# EAGLE design TCRT1010_VIS.pac (EAGLE 9.6.2)

## Sheet 1 of 2
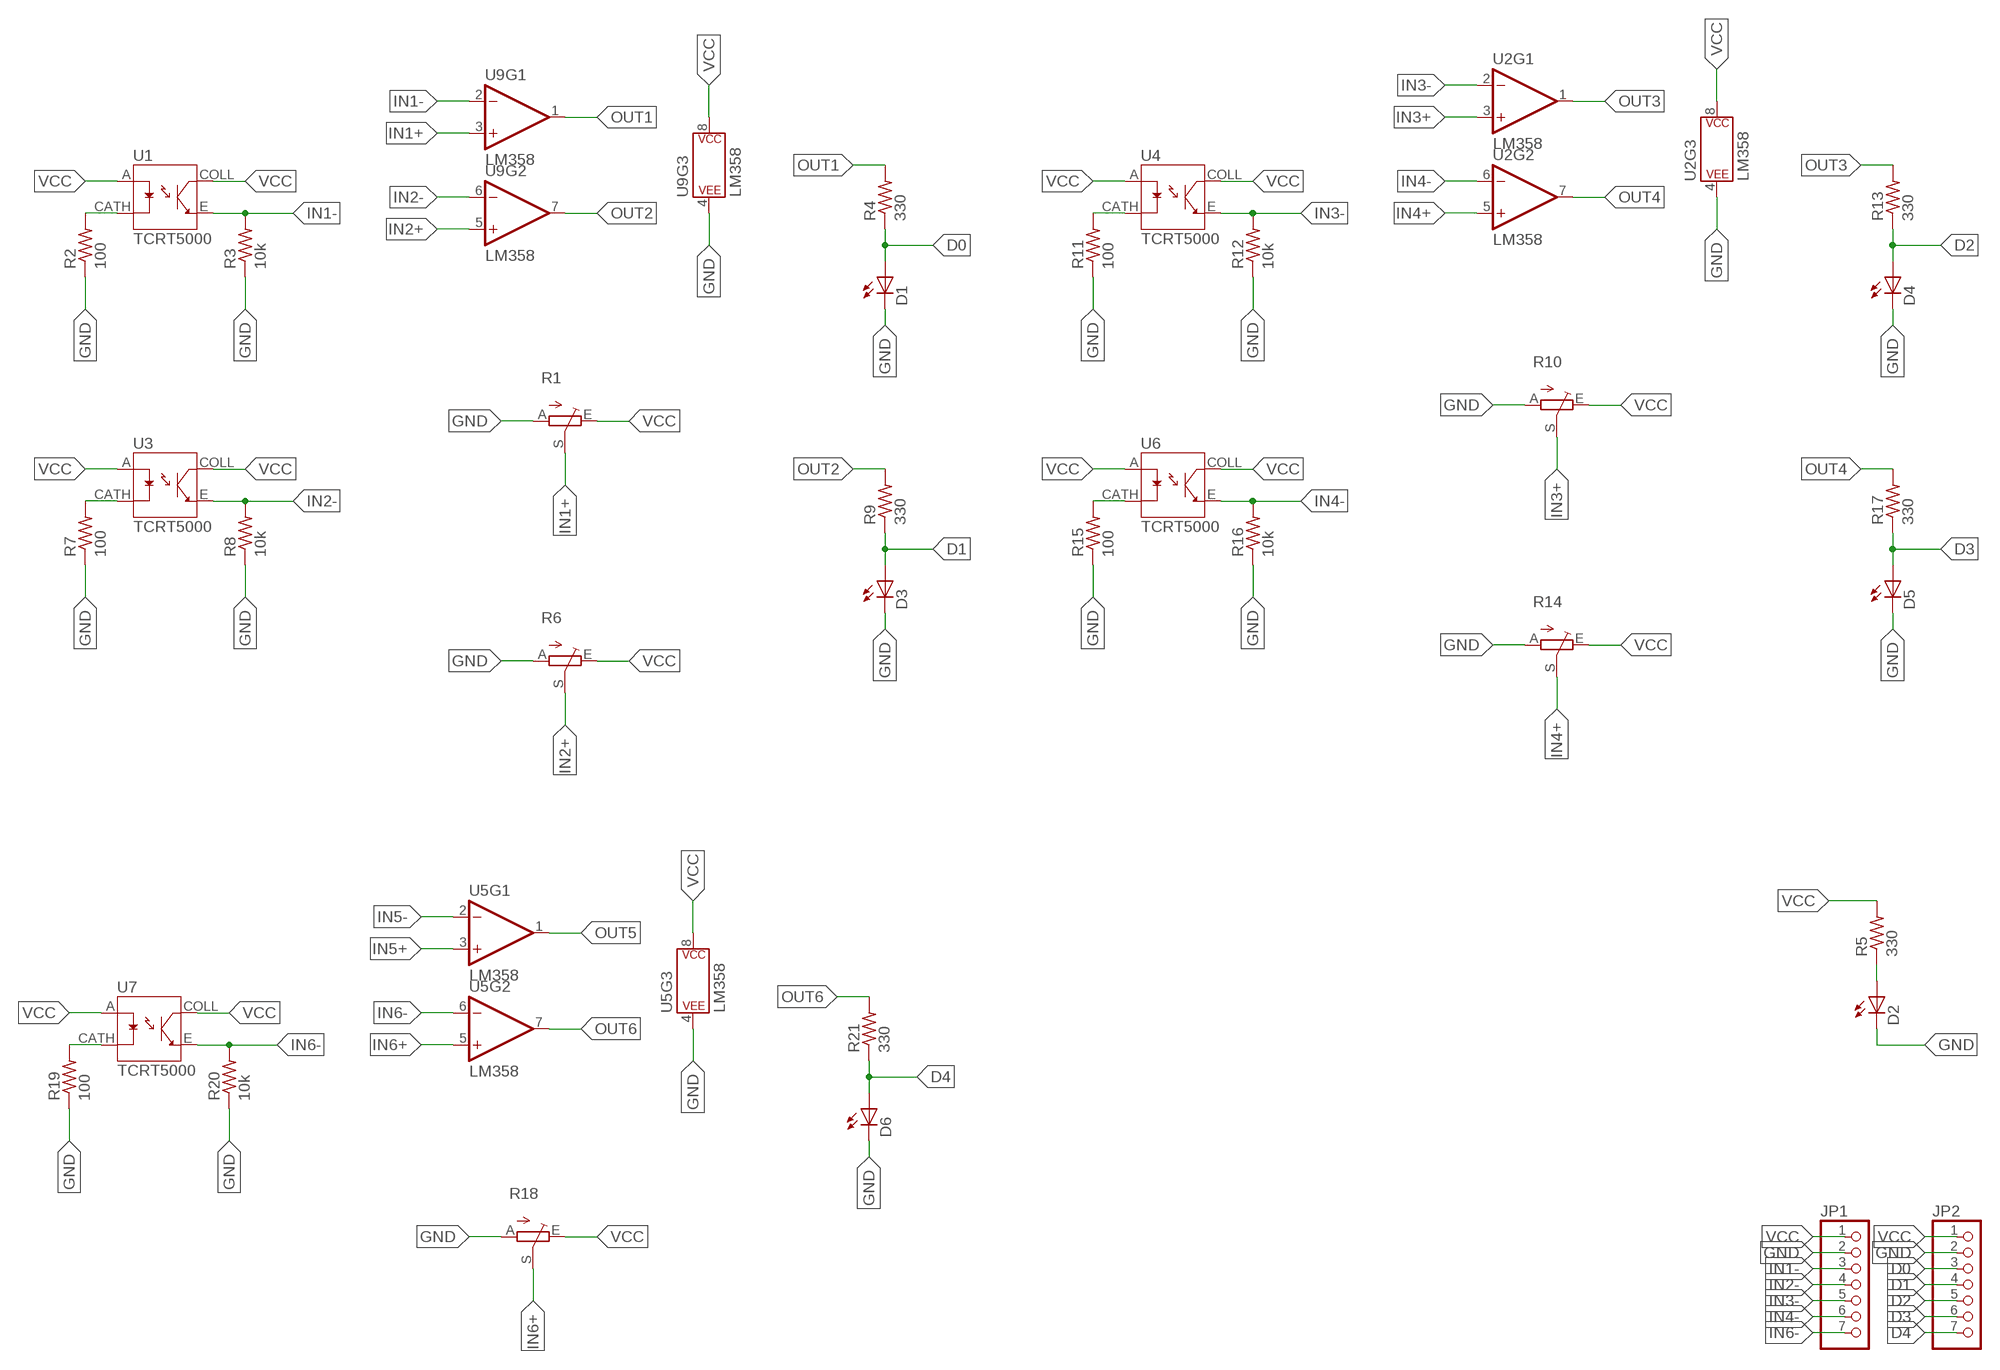
[diagram p0: schematic, sheet 1]

### Parts
D1  LED5MM  [LED5MM]
D2  LED5MM  [LED5MM]
D3  LED5MM  [LED5MM]
D4  LED5MM  [LED5MM]
D5  LED5MM  [LED5MM]
D6  LED5MM  [LED5MM]
JP1  PINHD-1X7  [1X07]
JP2  PINHD-1X7  [1X07]
R1  TRIM_EU-CA6V  [CA6V]
R2  100  RES-7  [0204/7]
R3  10k  RES-7  [0204/7]
R4  330  RES-7  [0204/7]
R5  330  RES-7  [0204/7]
R6  TRIM_EU-CA6V  [CA6V]
R7  100  RES-7  [0204/7]
R8  10k  RES-7  [0204/7]
R9  330  RES-7  [0204/7]
R10  TRIM_EU-CA6V  [CA6V]
R11  100  RES-7  [0204/7]
R12  10k  RES-7  [0204/7]
R13  330  RES-7  [0204/7]
R14  TRIM_EU-CA6V  [CA6V]
R15  100  RES-7  [0204/7]
R16  10k  RES-7  [0204/7]
R17  330  RES-7  [0204/7]
R18  TRIM_EU-CA6V  [CA6V]
R19  100  RES-7  [0204/7]
R20  10k  RES-7  [0204/7]
R21  330  RES-7  [0204/7]
U1  TCRT5000  [OPTO_TCRT5000]
U2  LM358  [DIP08]
U3  TCRT5000  [OPTO_TCRT5000]
U4  TCRT5000  [OPTO_TCRT5000]
U5  LM358  [DIP08]
U6  TCRT5000  [OPTO_TCRT5000]
U7  TCRT5000  [OPTO_TCRT5000]
U9  LM358  [DIP08]

### Nets
D0: D1.A JP2.3 R4.1
D1: D3.A JP2.4 R9.1
D2: D4.A JP2.5 R13.1
D3: D5.A JP2.6 R17.1
D4: D6.A JP2.7 R21.1
GND: D1.K(C) D2.K(C) D3.K(C) D4.K(C) D5.K(C) D6.K(C) JP1.2 JP2.2 R1.A R2.1 R3.1 R6.A R7.1 R8.1 R10.A R11.1 R12.1 R14.A R15.1 R16.1 R18.A R19.1 R20.1 U2.4(P$V-) U5.4(P$V-) U9.4(P$V-)
IN1+: R1.S U9.3(+IN)
IN1-: JP1.3 R3.2 U1.E U9.2(-IN)
IN2+: R6.S U9.5(+IN)
IN2-: JP1.4 R8.2 U3.E U9.6(-IN)
IN3+: R10.S U2.3(+IN)
IN3-: JP1.5 R12.2 U2.2(-IN) U4.E
IN4+: R14.S U2.5(+IN)
IN4-: JP1.6 R16.2 U2.6(-IN) U6.E
IN5+: U5.3(+IN)
IN5-: U5.2(-IN)
IN6+: R18.S U5.5(+IN)
IN6-: JP1.7 R20.2 U5.6(-IN) U7.E
N$1: R2.2 U1.CATH
N$2: D2.A R5.1
N$3: R7.2 U3.CATH
N$4: R11.2 U4.CATH
N$5: R15.2 U6.CATH
N$6: R19.2 U7.CATH
OUT1: R4.2 U9.1(OUT)
OUT2: R9.2 U9.7(OUT)
OUT3: R13.2 U2.1(OUT)
OUT4: R17.2 U2.7(OUT)
OUT5: U5.1(OUT)
OUT6: R21.2 U5.7(OUT)
VCC: JP1.1 JP2.1 R1.E R5.2 R6.E R10.E R14.E R18.E U1.A U1.COLL U2.8(P$V+) U3.A U3.COLL U4.A U4.COLL U5.8(P$V+) U6.A U6.COLL U7.A U7.COLL U9.8(P$V+)

## Sheet 2 of 2

## Library data of the parts
D1-D6 = MIA_LIBRARY-2-2-2:LED5MM
JP1 JP2 = MIA_LIBRARY-2-2-2:PINHD-1X7: PIN HEADER
R1 R6 R10 R14 R18 = MIA_LIBRARY-2-2-2:TRIM_EU-: POTENTIOMETER
R2-R5 R7-R9 R11-R13 R15-R17 R19-R21 = MIA_LIBRARY-2-2-2:RES-7
U1 U3 U4 U6 U7 = TCRT5000:TCRT5000: 950 nm 60 mA Through Hole Reflective Optical Sensor with Transistor Output Check availability <https://pricing.snapeda.com/parts/TCRT5000/Vishay/view-part?ref=eda>; AVAILABILITY: In Stock; DESCRIPTION: Reflective Optical Sensor 0.591 (15mm) PCB Mount; MF: Vishay; MP: TCRT5000; PACKAGE: TCRT5000 Vishay; PRICE: None; PURCHASE-URL: https://pricing.snapeda.com/search/part/TCRT5000/?ref=eda
U2 U5 U9 = MIA_LIBRARY-2-2-2:LM358: LM358 Jellybean op-amp Datasheet <http://www.sparkfun.com/datasheets/Components/General/LM358.pdf> SparkFun Products Op-Amp (Thru-Hole) - LM358 <https://www.sparkfun.com/products/9456> (COM-09456); PROD_ID: IC-09172

## Board
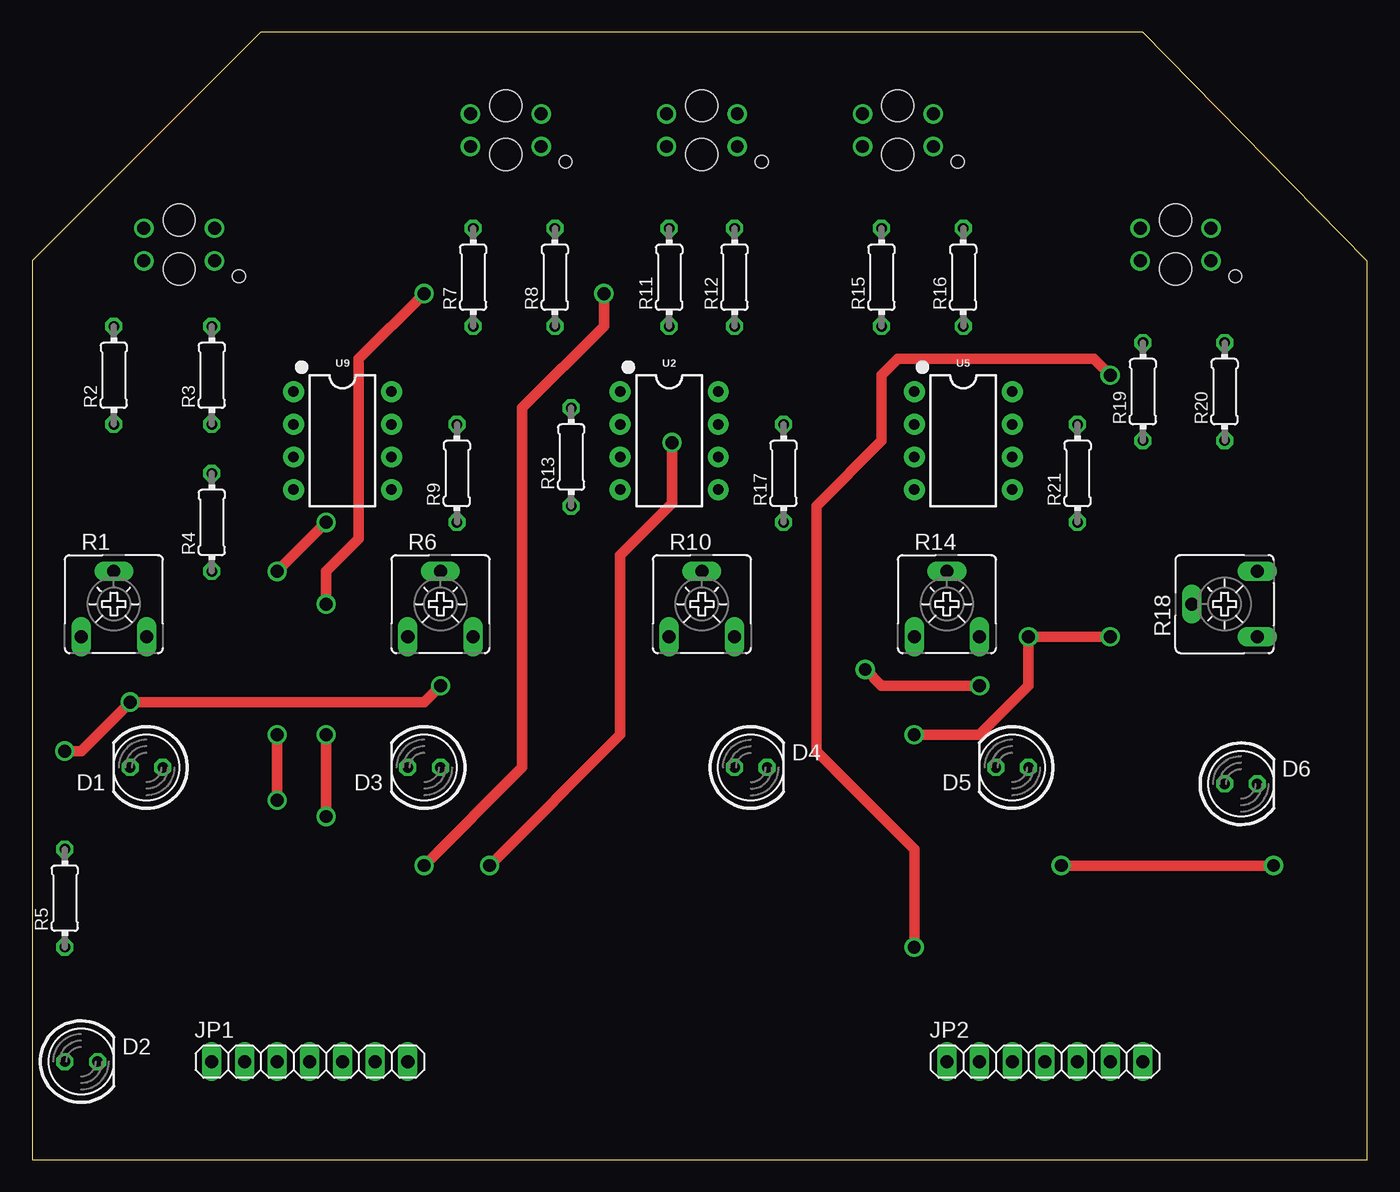
[diagram p1: board, top side]
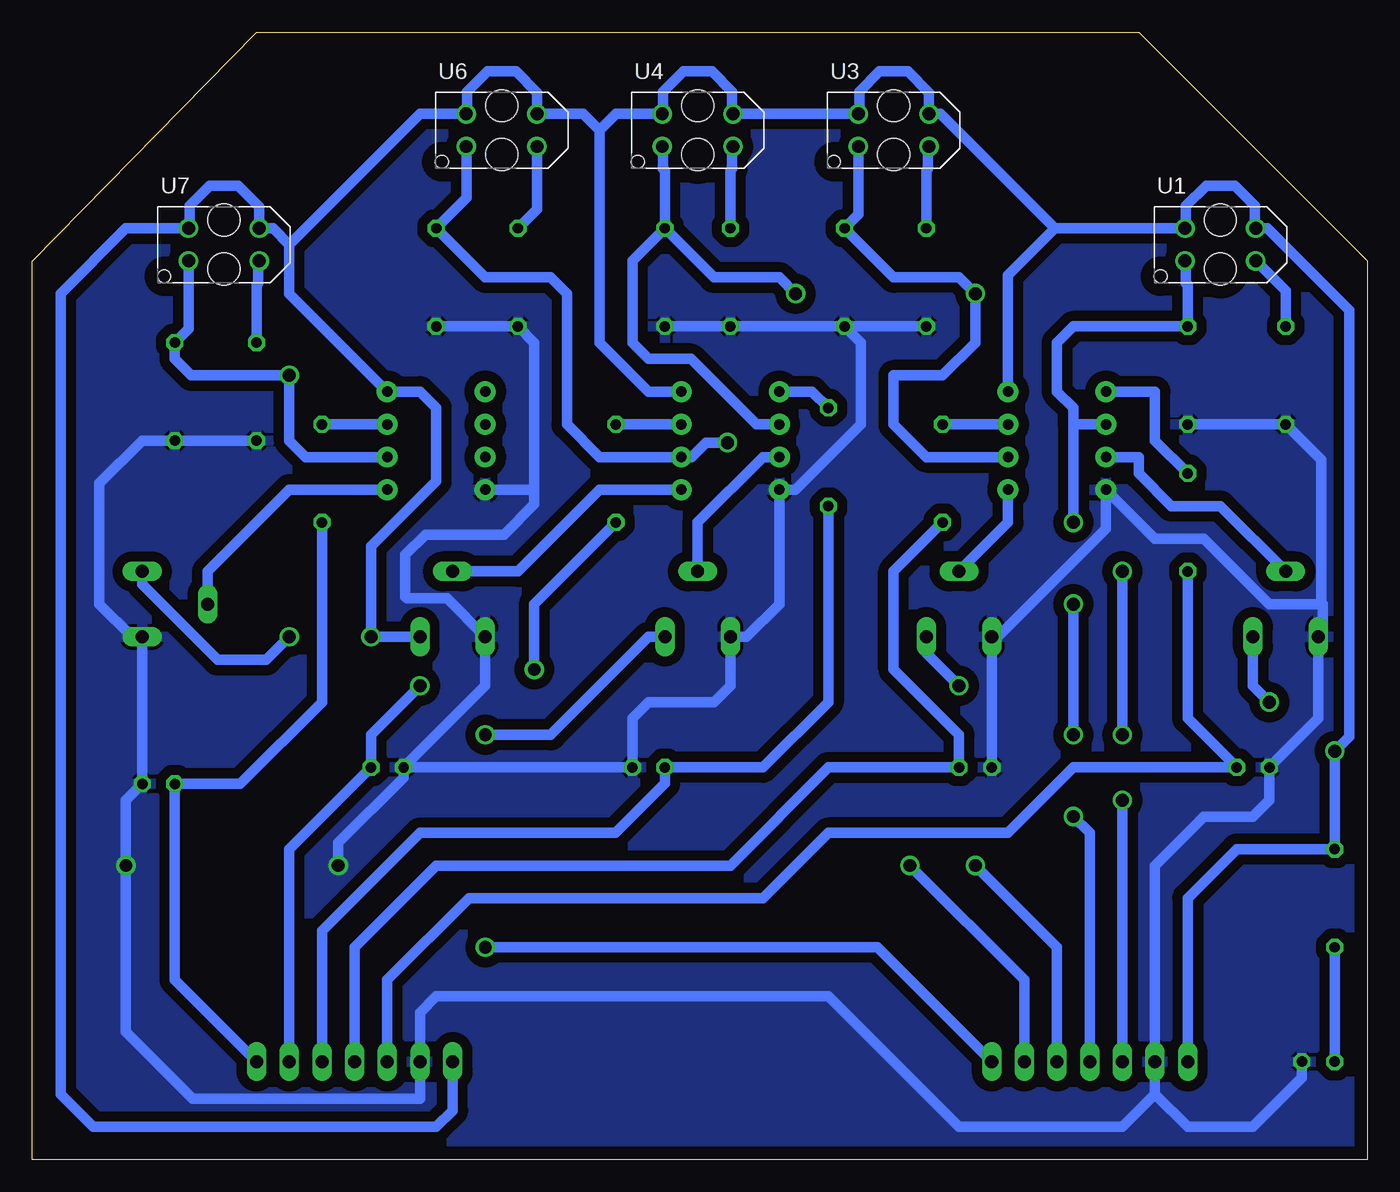
[diagram p2: board, bottom side, seen from below]

Size 103.81 x 87.63 mm. Coordinates in mm from the lower left corner, seen from the top.
Outline: 0,0 103.81,0 103.81,69.84 86.36,87.63 17.78,87.63 0,69.85 0,0
Copper layers (1*16): Top 0.035mm / dielectric 1.5mm / Bottom 0.035mm
Design rules "default *": minimum track width 6mil, minimum drill 0.35mm, track to track 0.8mm, track to pad 0.8mm, pad to pad 0.8mm, via to via 0.8mm, smd to smd 6mil, copper to edge 40mil, drill to drill 6mil, minimum pad ring 10mil, minimum via ring 8mil, stop-mask expansion 4mil, vias tented up to drill 0mil, thermal gap 10mil

### Footprints (pad centres in the part's own frame; a part is rotated, then mirrored left to right if it is on the bottom)
LED5MM = drill 0.813 octagon: A -1.27,0; K 1.27,0
1X07 = drill 1.016 long: 1 -7.62,0; 2 -5.08,0; 3 -2.54,0; 4 0,0; 5 2.54,0; 6 5.08,0; 7 7.62,0
CA6V = drill 1.016 long: A -2.54,-2.54; E 2.54,-2.54; S 0,2.54
0204/7 = drill 0.813 octagon: 1 -3.81,0; 2 3.81,0
OPTO_TCRT5000 = drill 1 pad 1.5: A 2.75,1.27; CATH 2.75,-1.27; COLL -2.75,1.27; E -2.75,-1.27 | hole 1: -4.65,-2.45 | hole 2.5: 0,-1.9; 0,1.9
DIP08 = drill 0.813 pad 1.626: 1 -3.81,-3.81; 2 -1.27,-3.81; 3 1.27,-3.81; 4 3.81,-3.81; 5 3.81,3.81; 6 1.27,3.81; 7 -1.27,3.81; 8 -3.81,3.81

### Placement (x,y rotation side)
D1  8.89,30.48 180 top
D2  3.81,7.62 0 top
D3  30.48,30.48 180 top
D4  55.88,30.48 0 top
D5  76.2,30.48 180 top
D6  93.98,29.21 0 top
JP1  21.59,7.62 0 top
JP2  78.74,7.62 0 top
R1  6.35,43.18 0 top
R2  6.35,60.96 90 top
R3  13.97,60.96 90 top
R4  13.97,49.53 90 top
R5  2.54,20.32 90 top
R6  31.75,43.18 0 top
R7  34.29,68.58 90 top
R8  40.64,68.58 90 top
R9  33.02,53.34 90 top
R10  52.07,43.18 0 top
R11  49.53,68.58 90 top
R12  54.61,68.58 90 top
R13  41.91,54.61 90 top
R14  71.12,43.18 0 top
R15  66.04,68.58 90 top
R16  72.39,68.58 90 top
R17  58.42,53.34 90 top
R18  92.71,43.18 90 top
R19  86.36,59.69 90 top
R20  92.71,59.69 90 top
R21  81.28,53.34 90 top
U1  11.43,71.12 0 bottom
U2  49.53,55.88 270 top
U3  36.83,80.01 0 bottom
U4  52.07,80.01 0 bottom
U5  72.39,55.88 270 top
U6  67.31,80.01 0 bottom
U7  88.9,71.12 0 bottom
U9  24.13,55.88 270 top

### Tracks (layer width: path | path; a pad name or v marks a point on that pad's centre or on a via)
D0
  Bottom 0.813: R4.1 13.97,34.29 D1.A 22.86,30.48 27.94,25.4 41.91,25.4 46.99,20.32 69.85,20.32 76.2,13.97 JP2.3
D1
  Bottom 0.813: R9.1 36.83,45.72 36.83,38.1 31.75,33.02 D3.A 41.91,30.48 49.53,22.86 72.39,22.86 78.74,16.51 JP2.4
D2
  Bottom 0.813: R13.1 41.91,35.56 46.99,30.48 D4.A 54.61,29.25 58.46,25.4 73.66,25.4 81.28,17.78 JP2.5
D3  (via drill 1)
  Top 0.813: v64.77,38.1 66.04,36.83 v73.66,36.83
  Bottom 0.813: JP2.6 83.82,24.13 D5.A 77.47,33.02 v73.66,36.83 | R17.1 64.77,43.18 v64.77,38.1
D4
  Bottom 0.813: JP2.7 92.71,13.97 D6.A 87.63,29.21 81.28,35.56 R21.1
GND  (via drill 1)
  Top 0.813: v80.01,22.86 v96.52,22.86
  Bottom 0.813: D3.K R6.A 28.72,40.64 20.32,49.04 U9.4 16.51,48.26 12.7,48.26 7.62,43.18 3.59,43.18 | 64.77,52.07 U5.4 | 64.77,52.07 64.77,50.93 67.12,48.58 73.24,48.58 74.8,47.01 74.8,43.77 74.67,43.63 71.57,43.63 R14.A 68.58,36.83 D5.K | D5.K D4.K 57.15,34.29 55.88,35.56 50.8,35.56 49.53,36.83 R10.A 48.26,40.64 45.72,43.18 U2.4 44.45,52.07 39.37,57.15 39.37,63.5 R8.1 | D2.K 5.08,6.35 8.89,2.54 13.97,2.54 16.51,5.08 | 16.51,5.08 JP1.2 16.51,22.86 12.7,26.67 8.89,26.67 7.62,27.94 D1.K 3.81,34.29 R1.A 3.47,40.98 3.47,43.18 3.59,43.18 | D5.K 74.93,29.7 80.01,24.62 v80.01,22.86 | 16.51,5.08 19.05,2.54 31.75,2.54 41.91,12.7 72.39,12.7 73.66,11.43 JP2.2 73.66,4.74 91.33,4.74 96.52,9.94 v96.52,22.86 96.52,27.94 D6.K R18.A 96.04,40.64 98.58,43.18 98.58,52.55 95.25,55.88 R20.1 R19.1 | R16.1 R15.1 64.77,63.5 64.77,52.07 | R7.1 R8.1 | R3.1 R2.1 3.59,54.39 3.59,43.18 | R12.1 R11.1 R8.1
  pour Bottom: 0,0 0,71.12 16.51,87.63 17.78,87.63 87.63,87.63 104.14,71.12 104.14,0
IN1+
  Bottom 0.813: R1.S 11.43,50.8 15.24,50.8 17.78,53.34 17.78,54.61 U9.3
IN1-  (via drill 1)
  Top 0.813: v22.86,49.53 v19.05,45.72 | v19.05,33.02 v19.05,27.94
  Bottom 0.813: U9.2 22.86,57.15 | 22.86,57.15 22.86,58.42 24.13,59.69 24.13,63.5 22.86,64.77 R3.2 13.97,67.98 14.1,68.11 14.1,69.77 U1.E | 22.86,57.15 v22.86,49.53 | v19.05,45.72 v19.05,33.02 | v19.05,27.94 JP1.3
IN2+
  Bottom 0.813: R6.S 27.94,49.53 U9.5
IN2-  (via drill 1)
  Top 0.813: v22.86,26.67 v22.86,33.02 | v22.86,43.18 22.86,45.72 25.4,48.26 25.4,62.23 v30.48,67.31
  Bottom 0.813: U9.6 34.29,54.61 36.83,57.15 36.83,60.96 33.02,60.96 30.48,63.5 v30.48,67.31 31.75,68.58 36.83,68.58 R8.2 39.56,73.47 39.56,78.36 39.58,78.38 U3.E | JP1.4 21.59,25.4 v22.86,26.67 | v22.86,33.02 v22.86,43.18
IN3+
  Bottom 0.813: U2.3 46.99,54.61 52.07,49.53 R10.S
IN3-  (via drill 1)
  Top 0.813: v30.48,22.86 38.1,30.48 38.1,58.42 44.45,64.77 v44.45,67.31
  Bottom 0.813: JP1.5 24.13,16.51 v30.48,22.86 | U2.2 47.51,57.15 52.59,62.23 55.88,62.23 57.15,63.5 57.15,69.85 R12.2 | R12.2 54.61,76.87 54.74,77 54.74,78.66 U4.E | R12.2 50.8,68.58 45.72,68.58 v44.45,67.31
IN4+
  Bottom 0.813: U2.5 59.69,52.07 66.04,45.72 R14.S
IN4-  (via drill 1)
  Top 0.813: v35.56,22.86 45.72,33.02 45.72,46.99 49.75,51.02 v49.75,55.73
  Bottom 0.813: JP1.6 26.67,13.97 v35.56,22.86 | v49.75,55.73 51.44,55.73 52.56,54.61 U2.6 59.69,54.61 62.23,57.15 62.23,67.31 63.5,68.58 68.58,68.58 R16.2 70.04,74.74 70.04,78.36 70.06,78.38 U6.E
IN6+
  Bottom 0.813: R18.S 90.17,45.72 83.82,52.07 U5.5
IN6-  (via drill 1)
  Top 0.813: v68.58,16.51 68.58,24.13 60.96,31.75 60.96,50.8 66.04,55.88 66.04,60.96 67.31,62.23 82.55,62.23 v83.82,60.96
  Bottom 0.813: U5.6 82.55,54.61 83.82,55.88 v83.82,60.96 91.44,60.96 92.71,62.23 R20.2 91.63,64.58 91.63,69.47 91.65,69.49 U7.E | JP1.7 38.1,16.51 v68.58,16.51
N$1
  Bottom 0.813: R2.2 6.35,67.52 U1.CATH
N$2
  Bottom 0.813: R5.1 D2.A
N$3
  Bottom 0.813: U3.CATH 34.16,78.66 34.16,77 34.29,76.87 R7.2
N$4
  Bottom 0.813: R11.2 49.53,76.87 49.4,77 49.4,78.66 U4.CATH
N$5
  Bottom 0.813: R15.2 64.56,73.87 U6.CATH
N$6
  Bottom 0.813: 86.57,63.71 R19.2 86.36,67.98 86.23,68.11 86.23,69.77 U7.CATH
OUT1
  Bottom 0.813: R4.2 16.51,55.88 16.51,59.69 U9.1
OUT2
  Bottom 0.813: R9.2 U9.7
OUT3
  Bottom 0.813: R13.2 43.18,59.69 U2.1
OUT4
  Bottom 0.813: R17.2 U2.7
OUT6
  Bottom 0.813: R21.2 U5.7
VCC  (via drill 1)
  Top 0.813: v2.54,31.75 3.81,31.75 v7.62,35.56 30.48,35.56 v31.75,36.83 | v83.82,40.64 v77.47,40.64 77.47,36.83 73.66,33.02 v68.58,33.02
  Bottom 0.813: U2.8 55.88,59.69 59.69,63.5 59.69,80.01 | U9.8 27.94,68.74 24.29,72.39 | R1.E 8.89,36.83 v7.62,35.56 | JP1.1 13.97,20.32 10.16,24.13 R5.2 v2.54,31.75 1.42,32.87 1.42,66.03 7.78,72.39 U1.A 8.76,72.47 8.76,74.13 10.32,75.69 12.54,75.69 14.1,74.13 14.1,72.47 U1.COLL 24.29,72.39 | R18.E 95.25,44.71 89.39,38.85 85.61,38.85 v83.82,40.64 | R14.E v77.47,40.64 77.47,47.66 72.39,52.74 72.39,58.42 73.66,59.69 U5.8 83.82,67.31 83.82,71.12 | JP2.1 71.12,3.81 72.39,2.54 99.06,2.54 101.6,5.08 101.6,67.31 96.52,72.39 U7.COLL 91.57,72.47 91.57,74.13 90.01,75.69 87.79,75.69 86.15,74.05 U7.A 85.09,72.39 83.82,71.12 | R6.E 34.29,39.37 v31.75,36.83 | R10.E 55.88,40.64 63.5,33.02 v68.58,33.02 | 24.29,72.39 33.18,81.28 U3.A 34.08,82.94 35.72,84.58 37.94,84.58 39.5,83.02 39.5,81.36 U3.COLL U4.A 49.4,81.36 49.4,83.02 50.96,84.58 53.18,84.58 54.74,83.02 54.74,81.36 U4.COLL 58.42,81.28 59.69,80.01 | 59.69,80.01 60.96,81.28 U6.A 64.56,82.94 66.2,84.58 68.42,84.58 69.98,83.02 69.98,81.36 U6.COLL 73.66,81.28 83.82,71.12